# EAGLE design Nano BMS Shield v0.1 (EAGLE 9.3.1)
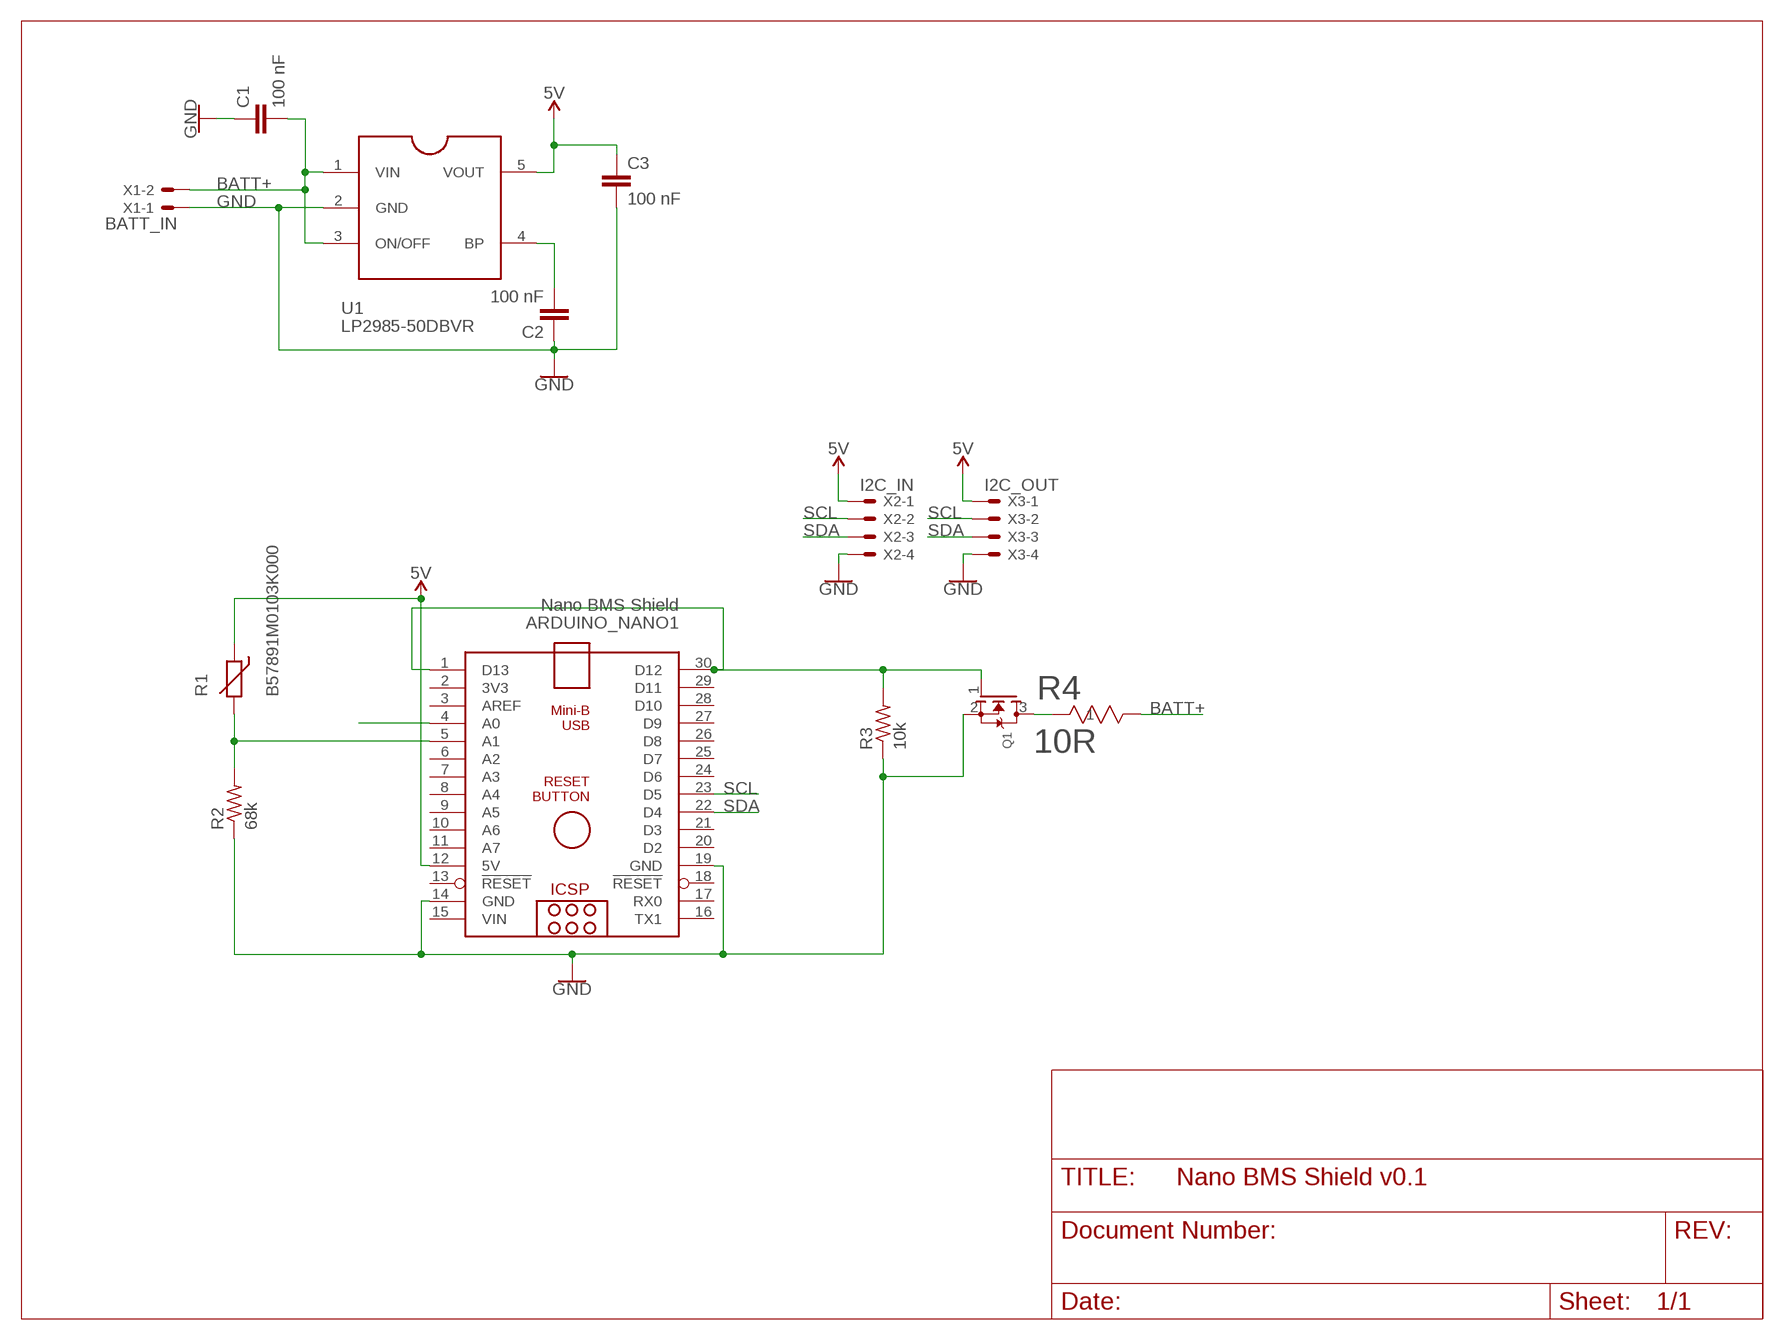
[diagram p0: schematic, sheet 1]

## Parts
ARDUINO_NANO1  Nano BMS Shield  ARDUINO_NANO  [ARDUINO_NANO]
C1  100 nF  C-EUC0603  [C0603]
C2  100 nF  C-EUC0603  [C0603]
C3  100 nF  C-EUC0603  [C0603]
Q1  MOSFET-NREFLOW  [SOT23]
R1  B57891M0103K000  THERMISTOR-2,5  [RS-2,5]
R2  68k  R-US_R0603  [R0603]
R3  10k  R-US_R0603  [R0603]
R4  10R  FMP300JT-73-10R  [YAG_FMP300]
U1  LP2985-50DBVR  [SOT23-5]
X1  BATT_IN  JST-XH-02-PIN-LONG-PAD  [JST-XH-02-PACKAGE-LONG-PAD]
X2  I2C_IN  JST-XH-04-PIN-LONG-PAD  [JST-XH-04-PACKAGE-LONG-PAD]
X3  I2C_OUT  JST-XH-04-PIN-LONG-PAD  [JST-XH-04-PACKAGE-LONG-PAD]

## Nets
5V: ARDUINO_NANO1.12(5V) C3.1 R1.1 U1.5(VOUT) X2.1 X3.1
BATT+: C1.2 R4.2 U1.1(VIN) U1.3(ON/OFF) X1.2
GND: ARDUINO_NANO1.14(GND) ARDUINO_NANO1.19(GND) C1.1 C2.1 C3.2 Q1.2(S) R2.1 R3.1 U1.2(GND) X1.1 X2.4 X3.4
N$1: ARDUINO_NANO1.1(D13) ARDUINO_NANO1.30(D12) Q1.1(G) R3.2
N$2: Q1.3(D) R4.1
N$3: ARDUINO_NANO1.4(A0)
N$4: ARDUINO_NANO1.5(A1) R1.2 R2.2
N$7: C2.2 U1.4(BP)
SCL: ARDUINO_NANO1.23(D5) X2.2 X3.2
SDA: ARDUINO_NANO1.22(D4) X2.3 X3.3
Unconnected: ARDUINO_NANO1.2(3V3) ARDUINO_NANO1.3(AREF) ARDUINO_NANO1.6(A2) ARDUINO_NANO1.7(A3) ARDUINO_NANO1.8(A4) ARDUINO_NANO1.9(A5) ARDUINO_NANO1.10(A6) ARDUINO_NANO1.11(A7) ARDUINO_NANO1.13(!RESET) ARDUINO_NANO1.16(TX1) ARDUINO_NANO1.17(RX0) ARDUINO_NANO1.18(!RESET) ARDUINO_NANO1.20(D2) ARDUINO_NANO1.21(D3) ARDUINO_NANO1.24(D6) ARDUINO_NANO1.25(D7) ARDUINO_NANO1.26(D8) ARDUINO_NANO1.27(D9) ARDUINO_NANO1.28(D10) ARDUINO_NANO1.29(D11)

## Power pins joined to a net without a drawn wire
VIN: ARDUINO_NANO1.15(VIN)

## Library data of the parts
ARDUINO_NANO1 = ArduinoNanoV30:ARDUINO_NANO: Arduino Nano V3.0 Overview: The Arduino Nano is a small, complete, and breadboard-friendly board based on the ATmega328 (Arduino Nano 3.x) or ATmega168 (Arduino Nano 2.x). It has more or less the same functionality of the Arduino Duemilanove, but in a different package. It lacks only a DC power jack, and works with a Mini-B USB cable instead of a standard one. The Nano was designed and is being produced by Gravitech. Specifications: Microcontroller Atmel ATmega168 or ATmega328 Operating Voltage (logic level) 5 V Input Voltage (recommended) 7-12 V Input Voltage (limits) 6-20 V Digital I/O Pins 14 (of which 6 provide PWM output) Analog Input Pins 8 DC Current per I/O Pin 40 mA Flash Memory 16 KB (ATmega168) or 32 KB (ATmega328) of which 2 KB used by bootloader SRAM 1 KB (ATmega168) or 2 KB (ATmega328) EEPROM 512 bytes (ATmega168) or 1 KB (ATmega328) Clock Speed 16 MHz Dimensions 0.73" x 1.70" Length 45 mm Width 18 mm Weigth 5 g Power: The Arduino Nano can be powered via the Mini-B USB connection, 6-20V unregulated external power supply (pin 30), or 5V regulated external power supply (pin 27). The power source is automatically selected to the highest voltage source. Memory: The ATmega168 has 16 KB of flash memory for storing code (of which 2 KB is used for the bootloader); the ATmega328 has 32 KB, (also with 2 KB used for the bootloader). The ATmega168 has 1 KB of SRAM and 512 bytes of EEPROM (which can be read and written with the EEPROM library); the ATmega328 has 2 KB of SRAM and 1 KB of EEPROM. Input and Output: Each of the 14 digital pins on the Nano can be used as an input or output, using pinMode(), digitalWrite(), and digitalRead() functions. They operate at 5 volts. Each pin can provide or receive a maximum of 40 mA and has an internal pull-up resistor (disconnected by default) of 20-50 kOhms. In addition, some pins have specialized functions. Visit Arduino - ArduinoBoardNano <https://www.arduino.cc/en/Main/ArduinoBoardNano>
C1-C3 = rcl:C-EU: CAPACITOR, European symbol; SPICEPREFIX: C
Q1 = adafruit:MOSFET-N: N-Channel Mosfet 2N7002E - 60V 260mA SOT23 [Digikey: 2N7002ET1GOSTR-ND] - REEL BSH103 - 30V 850mA SOT23 [Digikey: 568-5013-1-ND]
R1 = varistor:THERMISTOR: THERMISTOR
R2 R3 = resistor:R-US_: RESISTOR, American symbol
R4 = FMP300JT-73-10R:FMP300JT-73-10R; MANUFACTURER_PART_NUMBER: FMP300JT7310R; VENDOR: Yageo
U1 = LP2985-50DBVR:LP2985-50DBVR: http://octopart.com/lp2985-50dbvr-texas+instruments-525993; AVAILABILITY: Unavailable; DESCRIPTION: Single Output LDO, 150mA, Fixed_5.0V_, 1.5% Tolerance, Low Quiescent Current, Low Noise 5-SOT-23 -40 to 125; MF: Texas Instruments; MP: LP2985-50DBVR; PACKAGE: SOT-23 Texas Instruments; PRICE: None
X1 = Rembrandt Electronics - JST XH Connectors v1-0:JST-XH-02-PIN: JST XH Connector 2 Pin Wire to board connector. Pitch: 2,54 mm, (0.100") Number of pins: 2 Created by Rembrandt Electronics www.rembrandtelectronics.com
X2 X3 = Rembrandt Electronics - JST XH Connectors v1-0:JST-XH-04-PIN: JST XH Connector 2 Pin Wire to board connector. Pitch: 2,54 mm, (0.100") Number of pins: 4 Created by Rembrandt Electronics www.rembrandtelectronics.com

## Board
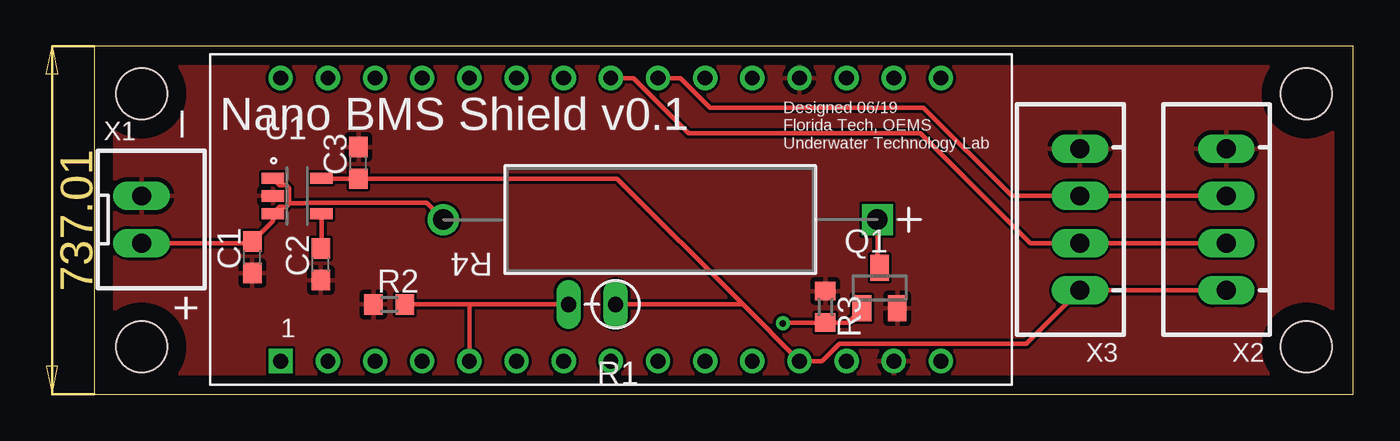
[diagram p1: board, top side]
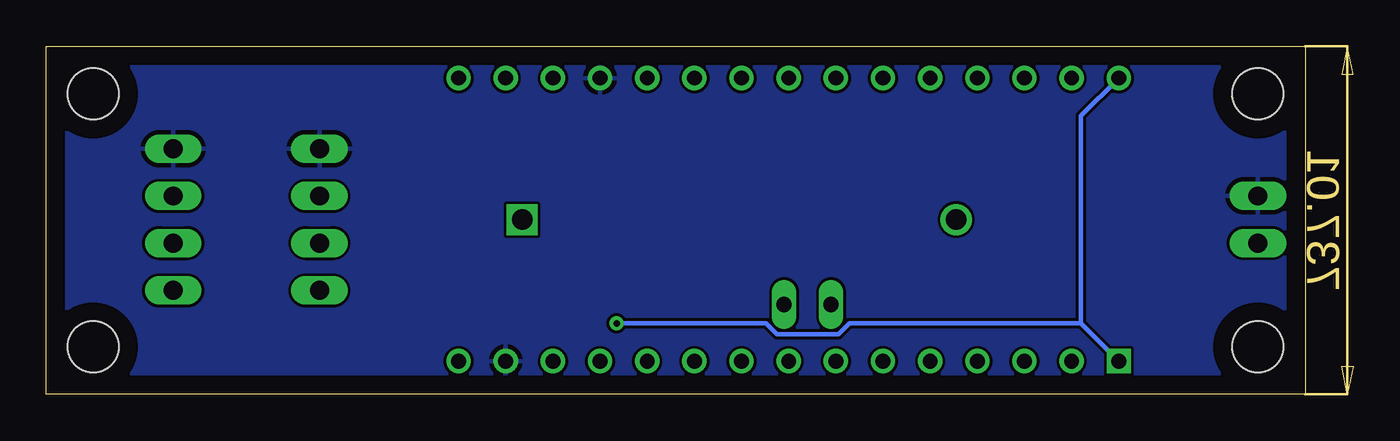
[diagram p2: board, bottom side, seen from below]

Size 67.79 x 18.72 mm. Coordinates in mm from the lower left corner, seen from the top.
Outline: 0,0 67.79,0 67.79,18.72 0,18.72 0,0
Copper layers (1*16): Top 0.035mm / dielectric 1.5mm / Bottom 0.035mm
Design rules "default": minimum track width 6mil, minimum drill 0.35mm, track to track 6mil, track to pad 6mil, pad to pad 6mil, via to via 6mil, smd to smd 6mil, copper to edge 40mil, drill to drill 6mil, minimum pad ring 10mil, minimum via ring 8mil, stop-mask expansion 4mil, vias tented up to drill 0mil, thermal gap 10mil
Holes 2.75 mm at 2.54,2.54 2.54,16.18 65.28,2.54 65.28,16.18

### Footprints (pad centres in the part's own frame; a part is rotated, then mirrored left to right if it is on the bottom)
ARDUINO_NANO = drill 0.8 square: 1 -20.32,-7.62 | drill 0.8: 2 -17.78,-7.62; 3 -15.24,-7.62; 4 -12.7,-7.62; 5 -10.16,-7.62; 6 -7.62,-7.62; 7 -5.08,-7.62; 8 -2.54,-7.62; 9 0,-7.62; 10 2.54,-7.62; 11 5.08,-7.62; 12 7.62,-7.62; 13 10.16,-7.62; 14 12.7,-7.62; 15 15.24,-7.62; 16 15.24,7.62; 17 12.7,7.62; 18 10.16,7.62; 19 7.62,7.62; 20 5.08,7.62; 21 2.54,7.62; 22 0,7.62; 23 -2.54,7.62; 24 -5.08,7.62; 25 -7.62,7.62; 26 -10.16,7.62; 27 -12.7,7.62; 28 -15.24,7.62; 29 -17.78,7.62; 30 -20.32,7.62
C0603 = smd 1.1 x 1: 1 -0.85,0; 2 0.85,0
SOT23 = smd 1 x 1.4: 1 -0.95,-1.1; 2 0.95,-1.1; 3 0,1.1
RS-2,5 = drill 0.813 long: 1 -1.27,0; 2 1.27,0
R0603 = smd 1 x 1.1: 1 -0.85,0; 2 0.85,0
YAG_FMP300 = drill 1.118 pad 1.626 square: 1 -23.368,0 | drill 1.118 pad 1.626: 2 0,0
SOT23-5 = smd 1.2 x 0.6: 1 -1.306,0.95; 2 -1.306,0; 3 -1.306,-0.95; 4 1.306,-0.95; 5 1.306,0.95
JST-XH-02-PACKAGE-LONG-PAD = drill 1.016 long: 1 -1.27,0; 2 1.27,0
JST-XH-04-PACKAGE-LONG-PAD = drill 1.016 long: 1 -3.81,0; 2 -1.27,0; 3 1.27,0; 4 3.81,0

### Placement (x,y rotation side)
ARDUINO_NANO1  30.35,9.4 0 top
C1  8.51,7.37 90 top
C2  12.19,6.99 90 top
C3  14.22,12.45 90 top
Q1  42.29,5.71 0 top
R1  26.8,4.83 180 top
R2  15.88,4.83 0 top
R3  39.37,4.7 270 top
R4  18.8,9.4 180 top
U1  10.92,10.67 0 top
X1  2.54,9.4 270 top
X2  60.96,9.4 90 top
X3  53.09,9.4 90 top

### Tracks (layer width: path | path; a pad name or v marks a point on that pad's centre or on a via)
5V
  Top 0.254: U1.5 12.25,11.6 C3.1 28.16,11.6 34.92,4.83 | 34.92,4.83 ARDUINO_NANO1.12 39.19,1.78 40.13,2.71 50.21,2.71 X3.1 X2.1 | R1.1 34.92,4.83
BATT+
  Top 0.254: X1.2 8.42,8.13 C1.2 9.62,9.32 U1.3 9.99,10.09 10.33,10.09 10.49,10.25 10.49,10.29 | 10.49,10.29 10.49,11.08 10.33,11.25 9.99,11.25 U1.1 | 10.49,10.29 11.5,10.29 11.51,10.3 17.9,10.3 R4.2
GND
  pour Top: 0,18.67 0,0 67.82,0 67.82,18.67
  pour Bottom: 0,18.67 0,0 67.82,0 67.82,18.67
N$1  (via drill 0.35)
  Top 0.254: Q1.1 40.58,3.85 R3.2 37.12,3.85 v37.08,3.81
  Bottom 0.254: 12.06,3.81 ARDUINO_NANO1.1 | v37.08,3.81 29.04,3.81 28.46,3.23 25.14,3.23 24.55,3.81 12.06,3.81 | 12.06,3.81 12.06,14.99 ARDUINO_NANO1.30
N$2
  Top 0.254: R4.1 42.16,6.94 Q1.3
N$4
  Top 0.254: R1.2 23.5,4.83 23.24,4.83 20.19,4.83 | 20.19,4.83 ARDUINO_NANO1.5 | R2.2 20.19,4.83
N$7
  Top 0.254: U1.4 12.23,7.87 C2.2
SCL
  Top 0.254: X2.2 53.21,8.13 X3.2 50.42,8.13 44.49,14.05 32,14.05 29.03,17.02 ARDUINO_NANO1.23
SDA
  Top 0.254: X2.3 X3.3 49.4,10.67 44.64,15.43 33.16,15.43 31.57,17.02 ARDUINO_NANO1.22

### Text on the board
tSilk: _ | Nano BMS Shield v0.1 | Designed 06/19 / Florida Tech, OEMS / Underwater Technology Lab | +